# Altium schematic sheet Beetech NanoEvery.SchDoc: Beetech Nano Every v3
size 420 x 297 mm
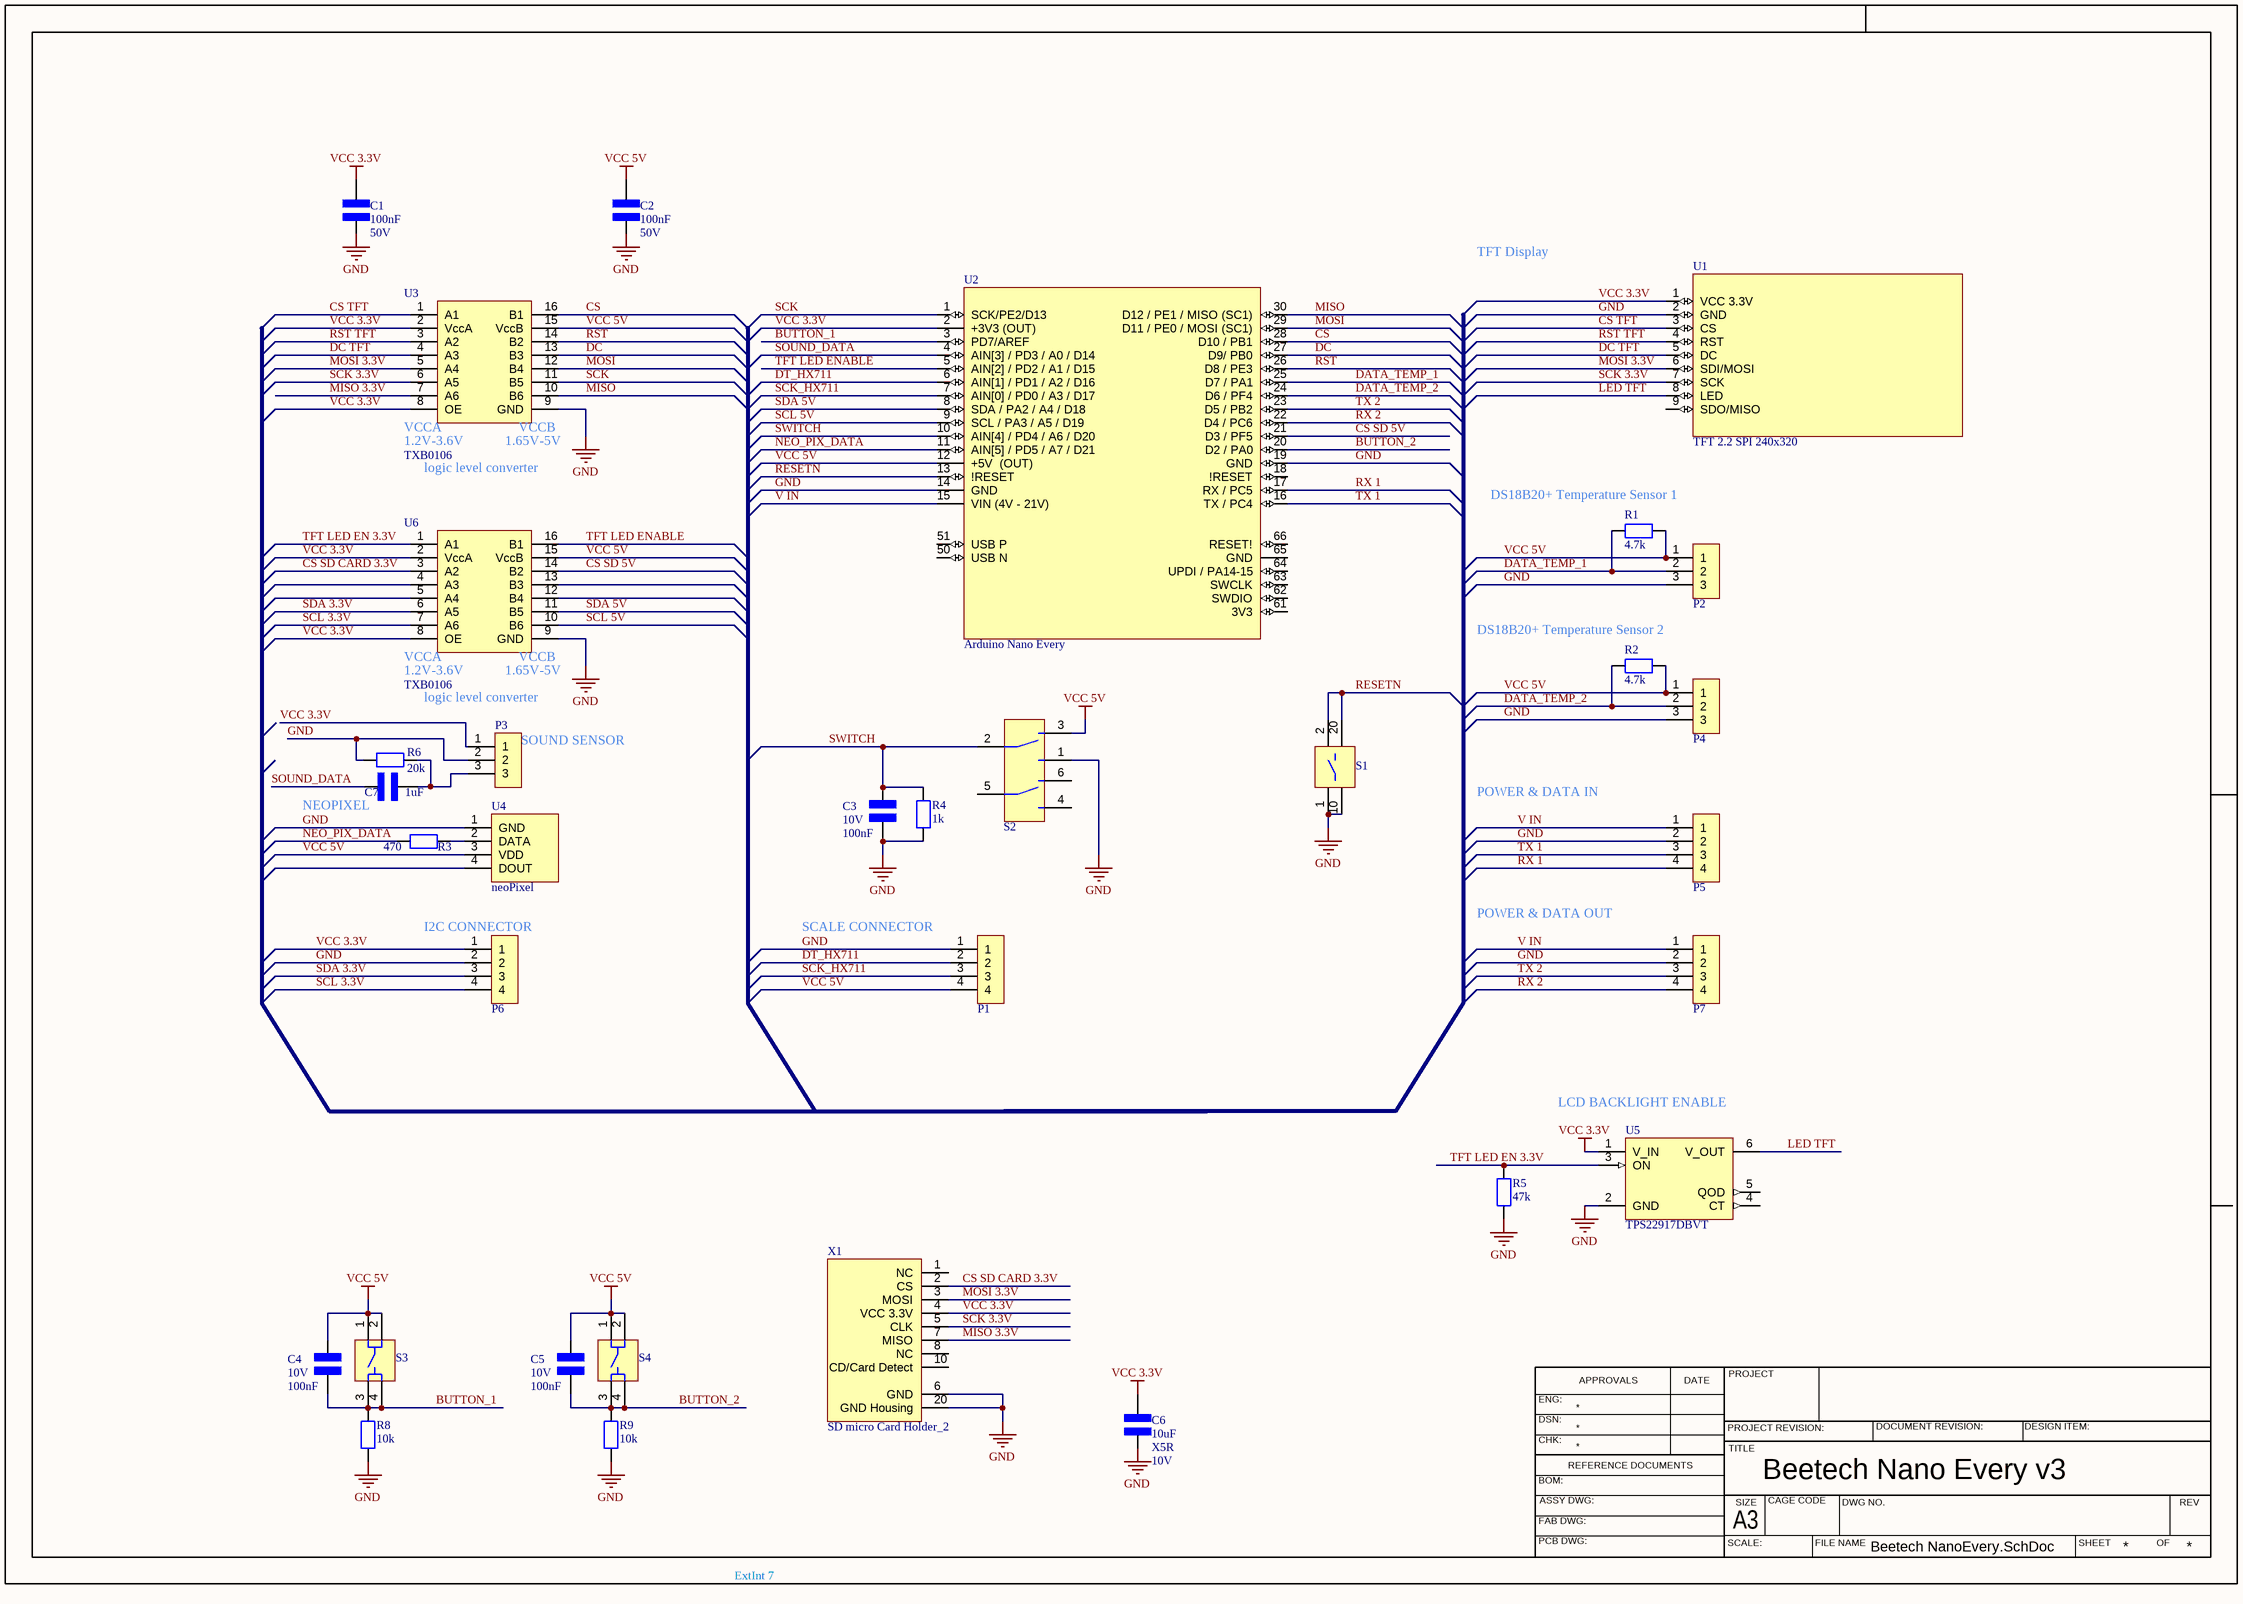
[diagram p0: Beetech NanoEvery.SchDoc]

## Parts
C1  value 100nF  Umax: 50V  [CAP 0603]  (hidden comment: 100nF 0603_1)
C2  value 100nF  Umax: 50V  [CAP 0603]  (hidden comment: 100nF 0603_1)
C3  value 100nF  Umax: 10V  [CAP 0603]  (hidden comment: 100nF 0603)
C4  value 100nF  Umax: 10V  [CAP 0603]  (hidden comment: 100nF 0603)
C5  value 100nF  Umax: 10V  [CAP 0603]  (hidden comment: 100nF 0603)
C6  value 10uF  Dielektrikum: X5R  Umax: 10V  [CAP 0603]  (hidden comment: 10uF 0603)
C7  value 1uF  [CAP 0805]  (hidden comment: 100nF 0805)
P1  4-Pin Right Angle Housing  [4PIN - RND 205-EK254-2.54-04P]  (value not drawn)
P2  3-Pin Right Angle Housing  [3PIN - RND 205-EK254-2.54-03P]  (value not drawn)
P3  3-Pin Right Angle Housing  [3PIN - RND 205-EK254-2.54-03P]  (value not drawn)
P4  3-Pin Right Angle Housing  [3PIN - RND 205-EK254-2.54-03P]  (value not drawn)
P5  4-Pin Right Angle Housing  [4PIN - RND 205-EK254-2.54-04P]  (value not drawn)
P6  4-Pin Right Angle Housing  [4PIN - RND 205-EK254-2.54-04P]  (value not drawn)
P7  4-Pin Right Angle Housing  [4PIN - RND 205-EK254-2.54-04P]  (value not drawn)
R1  value 4.7k  [RES 0603 FOOTPRINT]  (hidden comment: 4.7k Ohm 0603)
R2  value 4.7k  [RES 0603 FOOTPRINT]  (hidden comment: 4.7k Ohm 0603)
R3  value 470  [RES 0603 FOOTPRINT]  (hidden comment: 470 Ohm 0603)
R4  value 1k  [RES 0603 FOOTPRINT]  (hidden comment: 1k Ohm 0603)
R5  value 47k  [RES 0603 FOOTPRINT]  (hidden comment: 47k Ohm 0603)
R6  value 20k  [RES 0603 FOOTPRINT]  (hidden comment: 20k Ohm 0603)
R8  value 10k  [RES 0603 FOOTPRINT]  (hidden comment: 10k Ohm 0603)
R9  value 10k  [RES 0603 FOOTPRINT]  (hidden comment: 10k Ohm 0603)
S1  Taster Print_SMD_2  [Taster Print - SMD - KMR241G LFS]  (value not drawn)
S2  Schiebeschalter EG2207  [Schiebeschalter on-on 2 P, EG2207]  (value not drawn)
S3  Taster Print_SMD_3  [Taster Print - SMD - PTS647SM70SMTR2LFS]  (value not drawn)
S4  Taster Print_SMD_3  [Taster Print - SMD - PTS647SM70SMTR2LFS]  (value not drawn)
U1  TFT 2.2 SPI 240x320  [TFT 2.2 SPI 240x320]
U2  Arduino Nano Every  [Arduino Nano Every]
U3  TXB0106  [TSSOP-16L]
U4  neoPixel  [neoPixel 5050 adafruit 1655]
U5  TPS22917DBVT  [SOT23 - 6]
U6  TXB0106  [TSSOP-16L]
X1  SD micro Card Holder_2  [SD Card Holder - micro - 2 - sd Card inserted]

## Nets
GND: C1.1 C2.1 C3.2 C6.1 P1.1 P2.3 P3.2 P4.3 P5.2 P6.2 P7.2 R4.1 R5.1 R6.1 R8.1 R9.1 S1.1 S1.10 S2.1 U1.2(GND) U2.14(GND) U2.19(GND) U3.9(GND) U4.1(GND) U5.2(GND) U6.9(GND) X1.6(GND) X1.20(GND_Housing)
VCC 3.3V: C1.2 C6.2 P3.1 P6.1 U1.1(VCC_3.3V) U2.2(+3V3_(OUT)) U3.2(VccA) U3.8(OE) U5.1(V_IN) U6.2(VccA) U6.8(OE) X1.4(VCC_3.3V)
VCC 5V: C2.2 C4.1 C5.1 P1.4 P2.1 P4.1 R1.1 R2.1 S2.3 S3.1 S3.2 S4.1 S4.2 U2.12(+5V__(OUT)) U3.15(VccB) U4.3(VDD) U6.15(VccB)
BUTTON_1: C4.2 R8.2 S3.3 S3.4 U2.3(PD7/AREF)
BUTTON_2: C5.2 R9.2 S4.3 S4.4 U2.20(D2_/_PA0)
CS: U2.28(D10_/_PB1) U3.16(B1)
CS SD 5V: U2.21(D3_/_PF5) U6.14(B2)
CS SD CARD 3.3V: U6.3(A2) X1.2(CS)
CS TFT: U1.3(CS) U3.1(A1)
DATA_TEMP_1: P2.2 R1.2 U2.25(D7_/_PA1)
DATA_TEMP_2: P4.2 R2.2 U2.24(D6_/_PF4)
DC: U2.27(D9/_PB0) U3.13(B3)
DC TFT: U1.5(DC) U3.4(A3)
DT_HX711: P1.2 U2.6(AIN[1]_/_PD1_/_A2_/_D16)
LED TFT: U1.8(LED) U5.6(V_OUT)
MISO: U2.30(D12_/_PE1_/_MISO_(SC1)) U3.10(B6)
MISO 3.3V: U3.7(A6) X1.7(MISO)
MOSI: U2.29(D11_/_PE0_/_MOSI_(SC1)) U3.12(B4)
MOSI 3.3V: U1.6(SDI/MOSI) U3.5(A4) X1.3(MOSI)
NEO_PIX_DATA: R3.1 U2.11(AIN[5]_/_PD5_/_A7_/_D21)
RESETN: S1.2 S1.20 U2.13(!RESET)
RST: U2.26(D8_/_PE3) U3.14(B2)
RST TFT: U1.4(RST) U3.3(A2)
RX 1: P5.4 U2.17(RX_/_PC5)
RX 2: P7.4 U2.22(D4_/_PC6)
SCK: U2.1(SCK/PE2/D13) U3.11(B5)
SCK 3.3V: U1.7(SCK) U3.6(A5) X1.5(CLK)
SCK_HX711: P1.3 U2.7(AIN[0]_/_PD0_/_A3_/_D17)
SCL 3.3V: P6.4 U6.7(A6)
SCL 5V: U2.9(SCL_/_PA3_/_A5_/_D19) U6.10(B6)
SDA 3.3V: P6.3 U6.6(A5)
SDA 5V: U2.8(SDA_/_PA2_/_A4_/_D18) U6.11(B5)
SOUND_DATA: C7.1 U2.4(AIN[3]_/_PD3_/_A0_/_D14)
SWITCH: C3.1 R4.2 S2.2 U2.10(AIN[4]_/_PD4_/_A6_/_D20)
TFT LED EN 3.3V: R5.2 U5.3(ON) U6.1(A1)
TFT LED ENABLE: U2.5(AIN[2]_/_PD2_/_A1_/_D15) U6.16(B1)
TX 1: P5.3 U2.16(TX_/_PC4)
TX 2: P7.3 U2.23(D5_/_PB2)
V IN: P5.1 P7.1 U2.15(VIN_(4V_-_21V))
NetC7_2: C7.2 P3.3 R6.2
NetR3_2: R3.2 U4.2(DATA)

Not connected (* = marked no-connect by the designer): S2 4 5 6; U1 9(SDO/MISO); U2 18(!RESET) 50(USB_N) 51(USB_P) 61(3V3) 62(SWDIO) 63(SWCLK) 64(UPDI_/_PA14-15) 65(GND) 66(RESET!); U4 4(DOUT); U5 4(CT) 5(QOD); U6 4(A3) 5(A4) 12(B4) 13(B3); X1 1(NC) 8(NC) 10(CD/Card_Detect)

## Notes on the sheet
- TFT Display
- logic level converter
- (near R1) DS18B20+ Temperature Sensor 1
- (near R2) DS18B20+ Temperature Sensor 2
- (near P3) SOUND SENSOR
- POWER & DATA IN
- (near C7) NEOPIXEL
- (near P6) I2C CONNECTOR
- SCALE CONNECTOR
- POWER & DATA OUT
- (near U5) LCD BACKLIGHT ENABLE
- ExtInt 7
- ENG:
- APPROVALS
- DATE
- PROJECT
- DSN:
- CHK:
- REFERENCE DOCUMENTS
- PROJECT REVISION:
- TITLE
- DOCUMENT REVISION:
- DESIGN ITEM:
- BOM:
- FAB DWG:
- PCB DWG:
- ASSY DWG:
- SCALE:
- A3
- SIZE
- CAGE CODE
- FILE NAME
- DWG NO.
- SHEET
- OF
- REV
- (in symbol TXB0106 Level Converter) VCCA; VCCB; 1.2V-3.6V; 1.65V-5V

## Library data of the parts
C1 C2 = 100nF 0603_1: C CERAMIC SMD; Bezeichnung: C SMD; Hersteller: Yageo; Hersteller Nr: CC0603JPX7R9BB104; Haendler: Mouser; Haendler Nr: 603-CC0603JPX79BB104; Preis (CHF): 0.15; housing/footprint: 0603
C3-C5 = 100nF 0603: C CERAMIC SMD; Bezeichnung: C SMD; Hersteller: Würth; Hersteller Nr: 885012206020; Haendler: Mouser; Haendler Nr: 710-885012206020; Preis (CHF): 0.05; housing/footprint: 0603
C6 = 10uF 0603: C CERAMIC SMD; Bezeichnung: C SMD; Hersteller: TDK; Hersteller Nr: C1608X5R1A106K080AC; Haendler: Mouser; Haendler Nr: 810-C1608X5R1A106K; Preis (CHF): 0.5; housing/footprint: 0603
C7 = 100nF 0805: C CERAMIC SMD; Bezeichnung: C SMD; Haendler: Farnell; Haendler Nr: 2496946; Preis (CHF): 0.0126; housing/footprint: 0805
P1 P5-P7 = 4-Pin Screw Terminal: 4-Pin; Preis (CHF): 0.60; Haendler: Distrelec; Hersteller: RND; Hersteller Nr: RND 205-EK254-2.54-04P; Haendler Nr: 301-27-920; ComponentLink1Description: Mouser; ComponentLink1URL: https://www.mouser.ch/ProductDetail/TE-Connectivity/640453-2?qs=sGAEpiMZZMs%252bGHln7q6pm5E1Eb6qwPl2KIU5TYv3tVY%3d
P2-P4 = 3-Pin Screw Terminal: 3-Pin; Preis (CHF): 0.60; Haendler: Distrelec; Haendler Nr: 301-27-919; ComponentLink1Description: Mouser; ComponentLink1URL: https://www.mouser.ch/ProductDetail/TE-Connectivity/640453-2?qs=sGAEpiMZZMs%252bGHln7q6pm5E1Eb6qwPl2KIU5TYv3tVY%3d
R1 R2 = 4.7k Ohm 0603: R SMD; Haendler: Mouser; Haendler Nr: 755-ESR03EZPF4701; Preis (CHF): 0.01; Bezeichnung: R SMD; housing/footprint: 0603
R3 = 470 Ohm 0603: R SMD; Preis (CHF): 0.15; Haendler: Mouser; HAendler Nr: 594-MCT06030C4700FP5; Bezeichnung: R SMD; housing/footprint: 0603
R4 = 1k Ohm 0603: R SMD; Hersteller Nr: CRCW06031K00FKEAC; Haendler: Mouser; Haendler Nr: 71-CRCW06031K00FKEAC; Preis (CHF): 0.01; Bezeichnung: R SMD; housing/footprint: 0603
R5 = 47k Ohm 0603: R SMD; Hersteller: Yageo; Hersteller Nr: AC0603FR-0747KL; Haendler: Mouser; Haendler Nr: 603-AC0603FR-0747KL; Preis (CHF): 0.01; Bezeichnung: R SMD; housing/footprint: 0603
R6 = 20k Ohm 0603: R SMD; Haendler: Mouser; Haendler Nr: 71-CRCW060320K0FKEAC; Preis (CHF): 0.09; Bezeichnung: R SMD; housing/footprint: 0603
R8 R9 = 10k Ohm 0603: R SMD; Hersteller: Yageo; Hersteller Nr: AC0603FR-0710KL; Haendler: Mouser; Haendler Nr: 603-AC0603FR-0710KL; Preis (CHF): 0.01; Bezeichnung: R SMD; housing/footprint: 0603
S1 = Taster Print_SMD_2: Taster; Haendler Nr: 611-KMR241GLFS; Haendler: Mouser; Hersteller: C&K; Hersteller Nr: KMR241G LFS; Preis (CHF): 0.5; Haendler2 Nr: 1437637; Haendler2: Farnell; Link: http://ch.farnell.com/c-k-components/kmr241g-lfs/taster-smd-4n/dp/1437637; Link Hersteller: http://www.ckswitches.com/products/switches/product-details/Tactile/KMR2/KMR241NGLFS/
S2 = Schiebeschalter EG2207: Schiebeschalter on-on PCM12SMTR; Haendler: Mouser; Haendler Nr: 612-EG2207; Preis (CHF): 0.66; Hersteller: E SWITCH; Hersteller Nr: EG2207; ComponentLink1Description: C&K; ComponentLink1URL: https://www.ckswitches.com/products/switches/product-details/Slide/AYZ/AYZ0202AGRLC/
S3 S4 = Taster Print_SMD_6: Taster; Haendler Nr: 611-PTS647SM70SMTR2L; Haendler: Mouser; Preis (CHF): 0.38; Link: https://www.mouser.ch/ProductDetail/CK/PTS647SM70SMTR2LFS?qs=PqoDHHvF64%252Bxl5nIb9IaOw%3D%3D; ComponentLink1Description: link; ComponentLink1URL: https://www.digikey.ch/product-detail/de/wurth-electronics-inc/430473035826/732-7021-1-ND/5225469
U1 = TFT 2.2 SPI 240x320: https://www.banggood.com/1_441_82_02_22_4-Inch-TFT-LCD-Display-Module-Colorful-Screen-Module-SPI-Interface-p-1494883.html?rmmds=search&ID=6211522&cur_warehouse=CN; Preis (CHF): 6; Haendler: Banggood / Aliexpress; Link: https://www.banggood.com/1_441_82_02_22_4-Inch-TFT-LCD-Display-Module-Colorful-Screen-Module-SPI-Interface-p-1494883.html?rmmds=search&ID=6211522&cur_warehouse=CN; ComponentLink3URL: http://ch.farnell.com/stmicroelectronics/stm32l496vgt6/mcu-arm-cortex-m4-80mhz-lqfp-100/dp/2725139?st=STM32L496VGT6; Link 2: https://de.aliexpress.com/item/4000839144387.html?spm=a2g0o.productlist.0.0.48ed5371jjv3wJ&algo_pvid=f087815a-197e-468a-8055-d99fc6734484&algo_expid=f087815a-197e-468a-8055-d99fc6734484-8&btsid=0ab50f6115912653966648062e4a8e&ws_ab_test=searchweb0_0,searchweb201602_,searchweb201603_
U2 = Arduino Nano Every: https://store.arduino.cc/nano-every-pack; Preis (CHF): 11.21; Haendler: Mouser; Haendler Nr: 782-ABX00028; Link: https://store.arduino.cc/nano-every-pack; ComponentLink3URL: http://ch.farnell.com/stmicroelectronics/stm32l496vgt6/mcu-arm-cortex-m4-80mhz-lqfp-100/dp/2725139?st=STM32L496VGT6; Link 2: https://www.mouser.ch/ProductDetail/Arduino/ABX00028?qs=PzGy0jfpSMtit6rnFl8mVg%3D%3D
U3 U6 = TXB0106 Level Converter: Level Converter TXB0106; Hersteller: Texas Instruments; Haendler: Mouser; Haendler Nr: 595-TXB0106PWR; Preis (CHF): 1.45; Haendler2: Farnell; Haendler2 Nr: 1694679; Hersteller Nr: TXB0106; Link: http://ch.farnell.com/texas-instruments/txb0106pwr/txb-transceiver-tssop16/dp/1694679?ost=1694679&searchView=table&iscrfnonsku=false&ddkey=http%3Ade-CH%2FElement14_Switzerland%2Fsearch
U4 = neoPixel 5050 adafruit 1655: Preis (CHF): 0.60; Haendler Nr: 485-1655; Haendler: Mouser; Hersteller Nr: 1655; ComponentLink1Description: Mouser; ComponentLink1URL: https://www.mouser.ch/ProductDetail/TE-Connectivity/640453-2?qs=sGAEpiMZZMs%252bGHln7q6pm5E1Eb6qwPl2KIU5TYv3tVY%3d; Hersteller: Adafruit
U5 = TPS22917DBVT: High Side Switch; Hersteller: TI; Preis (CHF): 0.6; Haendler Nr: 595-TPS22917DBVT; Haendler: Mouser; Code_JEDEC: SOT 23-6; Hersteller Nr: TPS22917DBVT; Link: https://www.mouser.ch/ProductDetail/Texas-Instruments/TPS22917DBVT?qs=sGAEpiMZZMve4%2fbfQkoj%252bPJ2V24ZqG0%252bKgHGtqls2rU%3d
X1 = SD micro Card Holder_2: SD micro Card  Holder; Hersteller Nr: 502774-0891; Hersteller: Molex; Haendler2 Nr: 2064063; Haendler2: Farnell; Preis (CHF): 3.15; Haendler: Mouser; Haendler Nr: 538-502774-0891